# Altium project BadUSB.PrjPcb
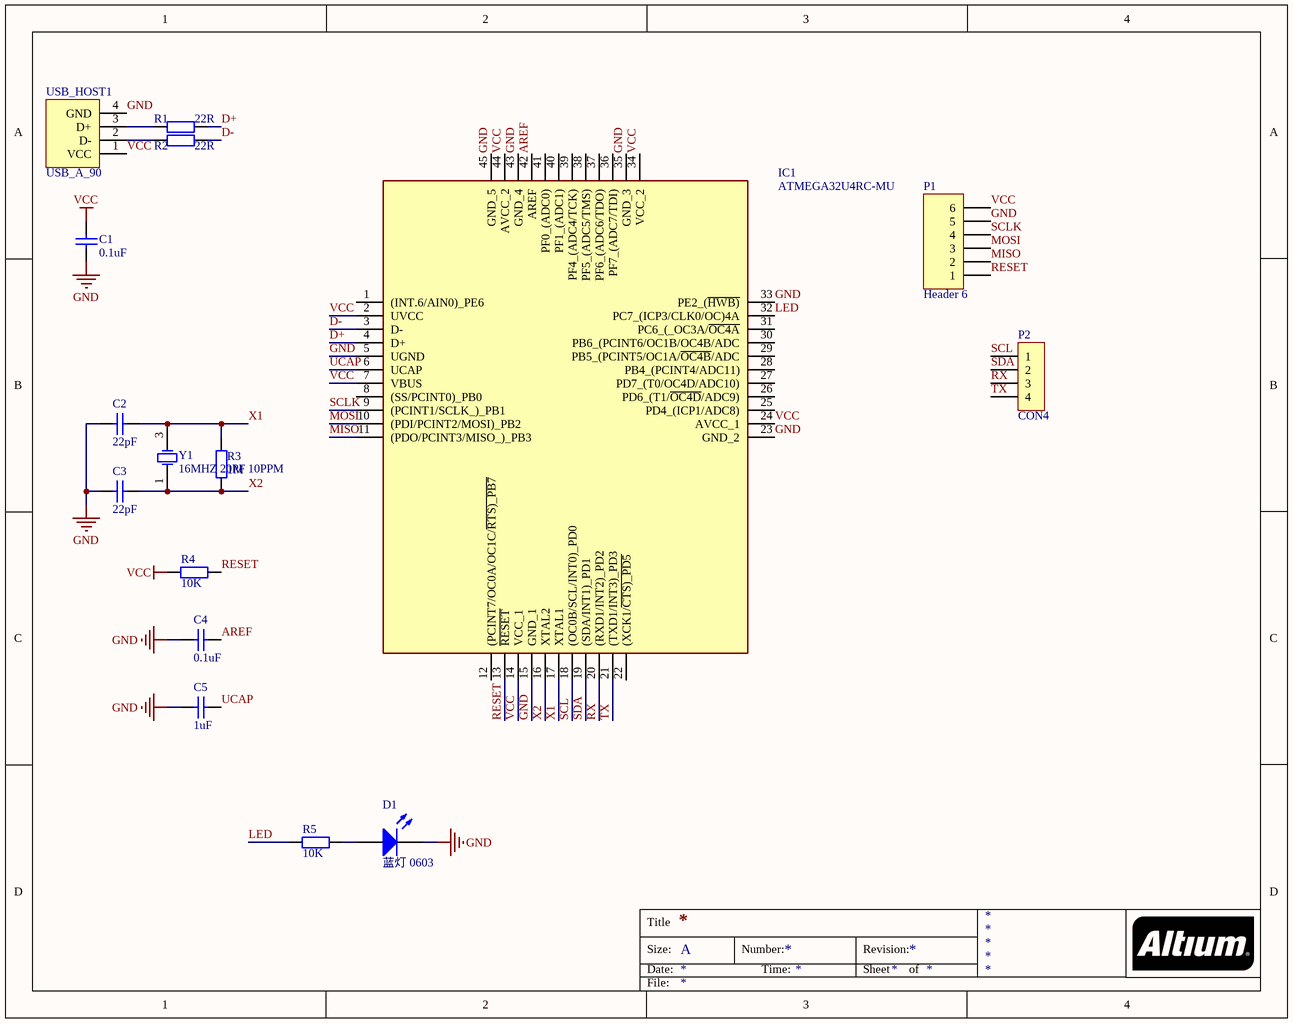
[diagram p0: BadUSB.SchDoc]
1 sheet, 16 parts. Net scope: global (net labels, ports and power ports of the same name join across sheets).
Board files: BadUSB.PcbDoc, BadUSB-去丝印.PcbDoc

## Sheet BadUSB.SchDoc
size A

### Parts
C1  0.1uF  [C 0603_L]
C2  22pF  [C 0603_L]
C3  22pF  [C 0603_L]
C4  0.1uF  [C 0603_L]
C5  1uF  [C 0603_L]
D1  蓝灯 0603  [0603_LED_S1]
IC1  ATMEGA32U4RC-MU  [QFN50P700X700X100-45N-D]
P1  Header 6  [HDR2.54-LI-6P]
P2  CON4  [HDR2.54-LI-4P]
R1  22R  [R 0603_L]
R2  22R  [R 0603_L]
R3  1M  [R 0603_L]
R4  10K  [R 0603_L]
R5  10K  [R 0603_L]
USB_HOST1  USB_A_90  [USB_A/P_B]
Y1  16MHZ 20PF 10PPM  [OSC 3225-4P]

### Nets
GND: C1.1 C2.2 C3.2 C4.2 C5.2 D1.K IC1.5(UGND) IC1.15(GND_1) IC1.23(GND_2) IC1.33(PE2_(~{HWB)}) IC1.35(GND_3) IC1.43(GND_4) IC1.45(GND_5) P1.5 USB_HOST1.4(GND)
VCC: C1.2 IC1.2(UVCC) IC1.7(VBUS) IC1.14(VCC_1) IC1.24(AVCC_1) IC1.34(VCC_2) IC1.44(AVCC_2) P1.6 R4.2 USB_HOST1.1(VCC)
AREF: C4.1 IC1.42(AREF)
D+: IC1.4(D+) R1.1
D-: IC1.3(D-) R2.1
LED: IC1.32(PC7_(ICP3/CLK0/OC)4A) R5.2
MISO: IC1.11((PDO/PCINT3/MISO_)_PB3) P1.2
MOSI: IC1.10((PDI/PCINT2/MOSI)_PB2) P1.3
RESET: IC1.13(~{RESET}) P1.1 R4.1
RX: IC1.20((RXD1/INT2)_PD2) P2.3
SCL: IC1.18((OC0B/SCL/INT0)_PD0) P2.1
SCLK: IC1.9((PCINT1/SCLK_)_PB1) P1.4
SDA: IC1.19((SDA/INT1)_PD1) P2.2
TX: IC1.21((TXD1/INT3)_PD3) P2.4
UCAP: C5.1 IC1.6(UCAP)
X1: C2.1 IC1.17(XTAL1) R3.2 Y1.3(OSC2)
X2: C3.1 IC1.16(XTAL2) R3.1 Y1.1(OSC1)
NetD1_A: D1.A R5.1
NetR1_2: R1.2 USB_HOST1.3(D+)
NetR2_2: R2.2 USB_HOST1.2(D-)

Not connected (* = marked no-connect by the designer): IC1 1((INT.6/AIN0)_PE6) 8((SS/PCINT0)_PB0) 12((PCINT7/OC0A/OC1C/~{RTS)_PB7}) 22((XCK1/~{CTS)_PD5}) 25(PD4_(ICP1/ADC8)) 26(PD6_(T1/~{OC4D}/ADC9)) 27(PD7_(T0/OC4D/ADC10)) 28(PB4_(PCINT4/ADC11)) 29(PB5_(PCINT5/OC1A/~{OC4B}/ADC) 30(PB6_(PCINT6/OC1B/OC4B/ADC) 31(PC6_(_OC3A/~{OC4A}) 36(PF7_(ADC7/TDI)) 37(PF6_(ADC6/TDO)) 38(PF5_(ADC5/TMS)) 39(PF4_(ADC4/TCK)) 40(PF1_(ADC1)) 41(PF0_(ADC0))

### Notes on the sheet
- Title
- Size:
- Date:
- A
- Number:
- Time:
- Revision:
- Sheet
- of
- File:

### Library data of the parts
C1-C5 = 0402 1.0uF (105) 10% 25V: 贴片电容; ComponentLink1Description: 供应商链接; ComponentLink1URL: http://www.szlcsc.com/product/details_53938.html; Package: 0402; Supplier: LC; SuppliersPartNumber: C52923
D1 = 0603 蓝灯: 发光二极管; ComponentLink1Description: 供应商链接; ComponentLink1URL: http://www.szlcsc.com/product/details_73150.html; Package: 0603; Supplier: LC; SuppliersPartNumber: C72041
IC1 = ATMEGA32U4RC-MU: Integrated Circuit; Manufacturer_Name: Microchip; Datasheet Link: http://ww1.microchip.com/downloads/en/DeviceDoc/Atmel-7766-8-bit-AVR-ATmega16U4-32U4_Datasheet.pdf; Height: 1mm; Manufacturer_Part_Number: ATMEGA32U4RC-MU; Arrow Part Number: ATMEGA32U4RC-MU; Arrow Price/Stock: https://www.arrow.com/en/products/atmega32u4rc-mu/microchip-technology; Mouser Part Number: 556-ATMEGA32U4RC-MU; Mouser Price/Stock: https://www.mouser.co.uk/ProductDetail/Microchip-Technology-Atmel/ATMEGA32U4RC-MU?qs=7AReRZHh%2FSu01hzuv0rGvg%3D%3D
P1 = Header 6: Header, 6-Pin; LatestRevisionDate: 17-Jul-2002; LatestRevisionNote: Re-released for DXP Platform.; Publisher: Altium Limited
P2 = CON4: Connector
R1-R5 = 0402 0Ω (0R0) 1%: 贴片电阻; ComponentLink1Description: 供应商链接; ComponentLink1URL: http://www.szlcsc.com/product/details_17853.html; Package: 0402; Supplier: LC; SuppliersPartNumber: C17168
Y1 = SMD-3225_4P  12MHZ 20PF 10PPM: 贴片晶振; ComponentLink1Description: 供应商链接; ComponentLink1URL: http://www.szlcsc.com/product/details_9522.html; Package: SMD-3225_4P; Supplier: LC; SuppliersPartNumber: C9002